# Altium schematic sheet GPS.SchDoc
size A; SheetNumber: 5; SheetTotal: 5
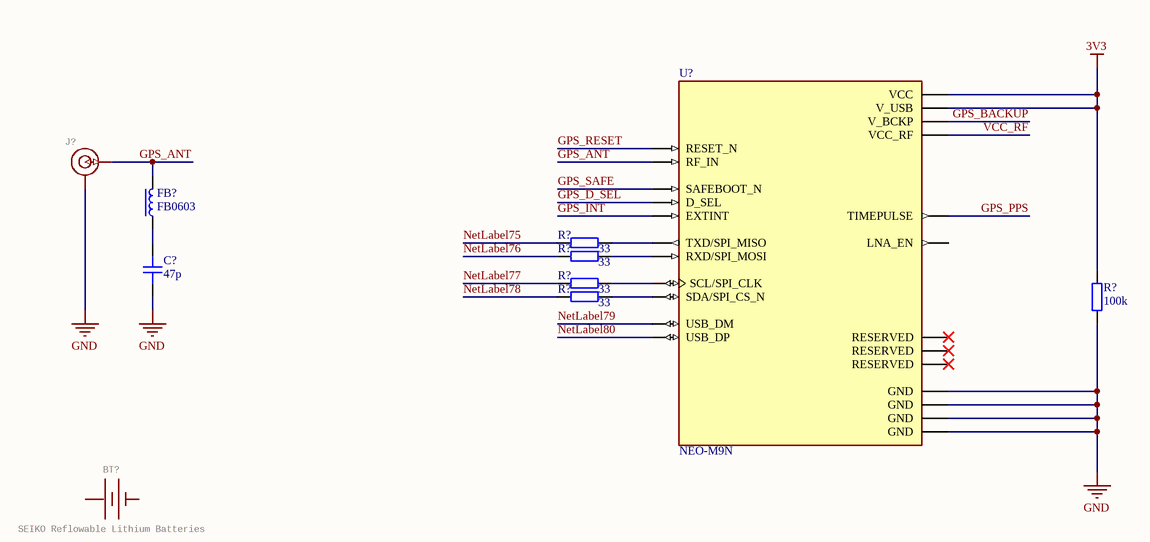
[diagram p0: GPS.SchDoc]

## Parts
(Parts that share a designator on the sheet are numbered #1, #2 ... from top to bottom, then left to right.)
BT?  SEIKO Reflowable Lithium Batteries  [ML414H_IV01E]
C?  47p  [CAP_0603]
FB?  FB0603  [FB_0603]
J?  SMD Antenna Connector - U.FL    2mm height, 3.0mm x 3.0mm receptacle size.    SparkFun Products: SparkFun WiFi Shield - ESP8266  SparkFun ESP8266 Thing  SparkFun MiniGen - Pro Mini Signal Generator Shield  [U-FL]  (value not drawn)
R?#1  33  [RES_0402]
R?#2  33  [RES_0402]
R?#3  33  [RES_0402]
R?#4  33  [RES_0402]
R?#5  100k  [RES_0402]
U?  NEO-M9N  [XCVR_NEO-M9N]

## Nets
3V3: R?#5.2 U?.7(V_USB) U?.23(VCC)
GND: C?.1 J?.1,2(GND) R?#5.1 U?.10(GND) U?.12(GND) U?.13(GND) U?.24(GND)
GPS_ANT: FB?.2 J?.FEED(SIGNAL) U?.11(RF_IN)
GPS_BACKUP: U?.22(V_BCKP)
GPS_D_SEL: U?.2(D_SEL)
GPS_INT: U?.4(EXTINT)
GPS_PPS: U?.3(TIMEPULSE)
GPS_RESET: U?.8(RESET_N)
GPS_SAFE: U?.1(SAFEBOOT_N)
NetLabel75: R?#1.1
NetLabel76: R?#2.1
NetLabel77: R?#3.1
NetLabel78: R?#4.1
NetLabel79: U?.5(USB_DM)
NetLabel80: U?.6(USB_DP)
VCC_RF: U?.9(VCC_RF)
NetC?_2: C?.2 FB?.1
NetR?#1_2: R?#1.2 U?.20(TXD/SPI_MISO)
NetR?#2_2: R?#2.2 U?.21(RXD/SPI_MOSI)
NetR?#3_2: R?#3.2 U?.19(SCL/SPI_CLK)
NetR?#4_2: R?#4.2 U?.18(SDA/SPI_CS_N)

Not connected (* = marked no-connect by the designer): BT? + -; U? 14(LNA_EN) 15(RESERVED)* 16(RESERVED)* 17(RESERVED)*

## Library data of the parts
BT? = RELOWABLE_BATTERY_ML414H: GateName_1: G$1; PROD_ID: BATT-14267; SymbolName_1: BATTERY; DeviceName: _ML414H; LibraryName: SparkFun-Batteries; DeviceSetName: RELOWABLE_BATTERY; Package: ML414H_IV01E
C? = CAP_0603: Capacitor SMD 0603; Manufacturer: *; Manufacturer Part Number: *; Distributor Link: *; LCSC: *; Rating: *; Dielectric: *
FB? = FB_0603: Ferrite Bead SMD 0603; Manufacturer: *; Manufacturer Part Number: *; Distributor Link: *; LCSC: *
J? = U.FL2PIN: GateName_1: J1; SymbolName_1: U.FL-1; PROD_ID: CONN-09193; SF_ID: WRL-09144; LibraryName: SparkFun-Connectors; DeviceSetName: U.FL2PIN; Package: U.FL
R?#1-R?#5 = RES_0402: Resistor SMD 0402; Manufacturer: *; Manufacturer Part Number: *; Distributor Link: *; LCSC: *
U? = NEO-M9N: series RF Receiver BeiDou, Galileo, GLONASS, GNSS, GPS - -167dBm - - Module; MF: U-Blox; Value: *; MP: NEO-M9N; SnapEDA_Link: https://www.snapeda.com/parts/NEO-M9N/u-blox/view-part/?ref=snap; Availability: In Stock; Package: SMD-24 u-blox; Check_prices: https://www.snapeda.com/parts/NEO-M9N/u-blox/view-part/?ref=eda; Price: None; Purchase-URL: https://pricing.snapeda.com/search/part/NEO-M9N/?ref=eda